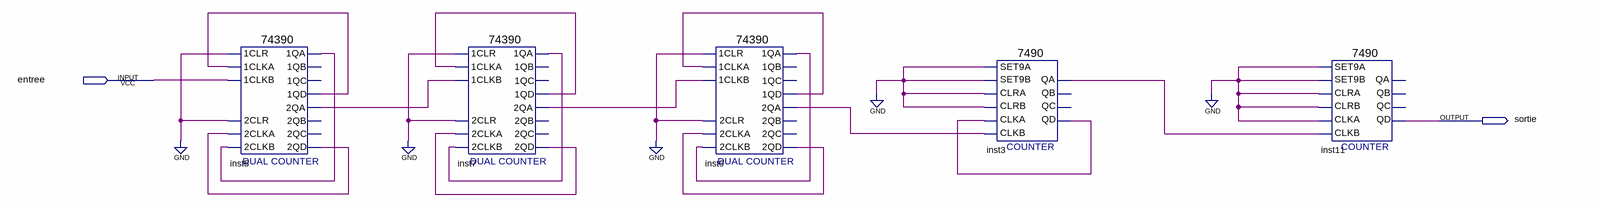
[diagram p0: schematic sheet]
// Quartus schematic compteur.bdf as structural Verilog: 5 symbols, 2 pins
module compteur (
  input  entree,
  output sortie
);

  wire inst3_qa, inst3_qd, inst5_1qa, inst5_1qd, inst5_2qa, inst5_2qd, inst7_1qa, inst7_1qd, inst7_2qa,
       inst7_2qd, inst9_1qa, inst9_1qd, inst9_2qa, inst9_2qd;

  \74390  inst5 (
    .\2CLKA (inst5_2qd), .\2CLR (1'b0), .\2CLKB (inst5_1qa), .\1CLR (1'b0), .\1CLKA (inst5_1qd),
    .\1CLKB (entree), .\1QA (inst5_1qa), .\1QD (inst5_1qd), .\2QA (inst5_2qa), .\2QD (inst5_2qd));  // open: 1QB, 1QC, 2QB, 2QC
  \74390  inst7 (
    .\2CLKA (inst7_2qd), .\2CLR (1'b0), .\2CLKB (inst7_1qa), .\1CLR (1'b0), .\1CLKA (inst7_1qd),
    .\1CLKB (inst5_2qa), .\1QA (inst7_1qa), .\1QD (inst7_1qd), .\2QA (inst7_2qa), .\2QD (inst7_2qd));  // open: 1QB, 1QC, 2QB, 2QC
  \74390  inst9 (
    .\2CLKA (inst9_2qd), .\2CLR (1'b0), .\2CLKB (inst9_1qa), .\1CLR (1'b0), .\1CLKA (inst9_1qd),
    .\1CLKB (inst7_2qa), .\1QA (inst9_1qa), .\1QD (inst9_1qd), .\2QA (inst9_2qa), .\2QD (inst9_2qd));  // open: 1QB, 1QC, 2QB, 2QC
  \7490  inst3 (
    .SET9A(1'b0), .CLRA(1'b0), .SET9B(1'b0), .CLKB(inst9_2qa), .CLKA(inst3_qd), .CLRB(1'b0), .QD(inst3_qd),
    .QA(inst3_qa));  // open: QB, QC
  \7490  inst11 (
    .SET9A(1'b0), .CLRA(1'b0), .SET9B(1'b0), .CLKB(inst3_qa), .CLKA(1'b0), .CLRB(1'b0), .QD(sortie));  // open: QA, QB, QC
endmodule
